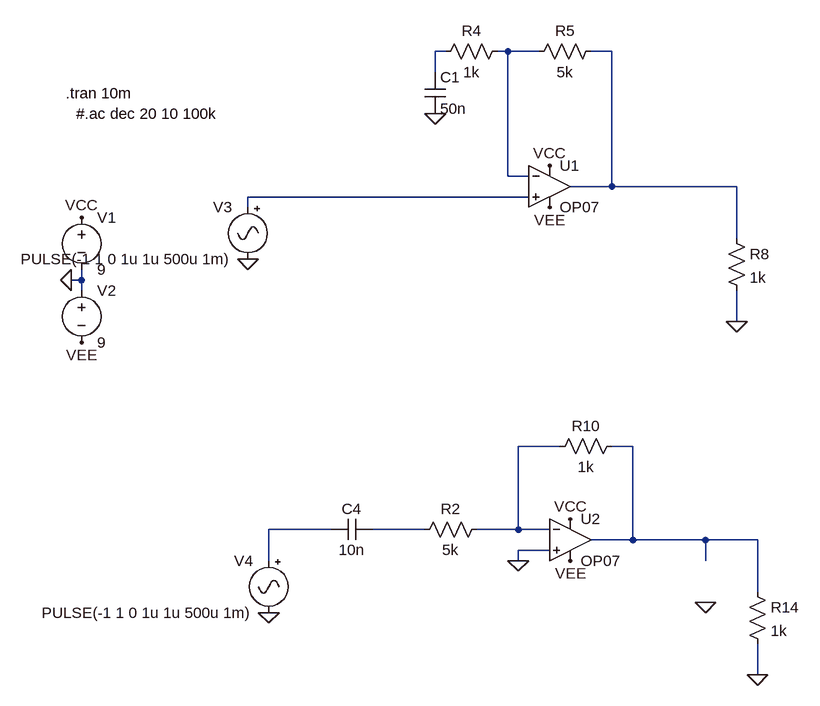
[diagram p0: schematic trebble.asc]
trebble.asc, the LTspice schematic file:
Version 4
SHEET 1 1012 960
WIRE 464 -16 448 -16
WIRE 560 -16 544 -16
WIRE 608 -16 560 -16
WIRE 720 -16 688 -16
WIRE 448 16 448 -16
WIRE 560 176 560 -16
WIRE 592 176 560 176
WIRE 720 192 720 -16
WIRE 720 192 656 192
WIRE 912 192 720 192
WIRE 592 208 160 208
WIRE 160 224 160 208
WIRE 912 272 912 192
WIRE -96 336 -96 320
WIRE -96 336 -112 336
WIRE -96 352 -96 336
WIRE 912 400 912 352
WIRE 640 592 576 592
WIRE 752 592 720 592
WIRE 288 720 192 720
WIRE 432 720 352 720
WIRE 576 720 576 592
WIRE 576 720 512 720
WIRE 624 720 576 720
WIRE 752 736 752 592
WIRE 752 736 688 736
WIRE 864 736 752 736
WIRE 944 736 864 736
WIRE 624 752 576 752
WIRE 192 768 192 720
WIRE 576 768 576 752
WIRE 864 768 864 736
WIRE 944 816 944 736
WIRE 944 944 944 896
FLAG -96 240 VCC
FLAG -112 336 0
FLAG -96 432 VEE
FLAG 160 304 0
FLAG 624 160 VCC
FLAG 624 224 VEE
FLAG 912 400 0
FLAG 192 848 0
FLAG 656 704 VCC
FLAG 656 768 VEE
FLAG 944 944 0
FLAG 576 768 0
FLAG 864 832 0
FLAG 448 80 0
SYMBOL voltage -96 224 R0
SYMATTR InstName V1
SYMATTR Value 9
SYMBOL voltage -96 336 R0
SYMATTR InstName V2
SYMATTR Value 9
SYMBOL Misc/signal 160 208 M0
SYMATTR InstName V3
SYMATTR Value PULSE(-1 1 0 1u 1u 500u 1m)
SYMATTR Value2 AC 1 0
SYMBOL OpAmps/OP07 624 128 R0
SYMATTR InstName U1
SYMBOL res 560 -32 R90
WINDOW 0 0 56 VBottom 2
WINDOW 3 32 56 VTop 2
SYMATTR InstName R4
SYMATTR Value 1k
SYMBOL res 704 -32 R90
WINDOW 0 0 56 VBottom 2
WINDOW 3 32 56 VTop 2
SYMATTR InstName R5
SYMATTR Value 5k
SYMBOL cap 432 16 R0
SYMATTR InstName C1
SYMATTR Value 50n
SYMBOL res 896 256 R0
SYMATTR InstName R8
SYMATTR Value 1k
SYMBOL Misc/signal 192 752 M0
SYMATTR InstName V4
SYMATTR Value PULSE(-1 1 0 1u 1u 500u 1m)
SYMATTR Value2 AC 1 0
SYMBOL OpAmps/OP07 656 672 R0
SYMATTR InstName U2
SYMBOL res 528 704 R90
WINDOW 0 0 56 VBottom 2
WINDOW 3 32 56 VTop 2
SYMATTR InstName R2
SYMATTR Value 5k
SYMBOL res 736 576 R90
WINDOW 0 0 56 VBottom 2
WINDOW 3 32 56 VTop 2
SYMATTR InstName R10
SYMATTR Value 1k
SYMBOL res 928 800 R0
SYMATTR InstName R14
SYMATTR Value 1k
SYMBOL cap 352 704 R90
WINDOW 0 0 32 VBottom 2
WINDOW 3 32 32 VTop 2
SYMATTR InstName C4
SYMATTR Value 10n
TEXT -120 48 Left 2 !.tran 10m
TEXT -104 80 Left 2 !#.ac dec 20 10 100k

The netlist it stands for:
* trebble.asc
V1 VCC 0 9
V2 0 VEE 9
V3 N004 0 PULSE(-1 1 0 1u 1u 500u 1m) AC 1 0
XU1 N004 N002 VCC VEE N003 LT1001  ; OP07, pins In+ In- V+ V- OUT
R4 N002 N001 1k
R5 N003 N002 5k
C1 N001 0 50n
R8 N003 0 1k
V4 N007 0 PULSE(-1 1 0 1u 1u 500u 1m) AC 1 0
XU2 0 N005 VCC VEE N006 LT1001  ; OP07, pins In+ In- V+ V- OUT
R2 N005 N008 5k
R10 N006 N005 1k
R14 N006 0 1k
C4 N008 N007 10n
.tran 10m
#.ac dec 20 10 100k
.lib LTC.lib
.backanno
.end